# Altium schematic sheet SensorCheck.SchDoc
size A
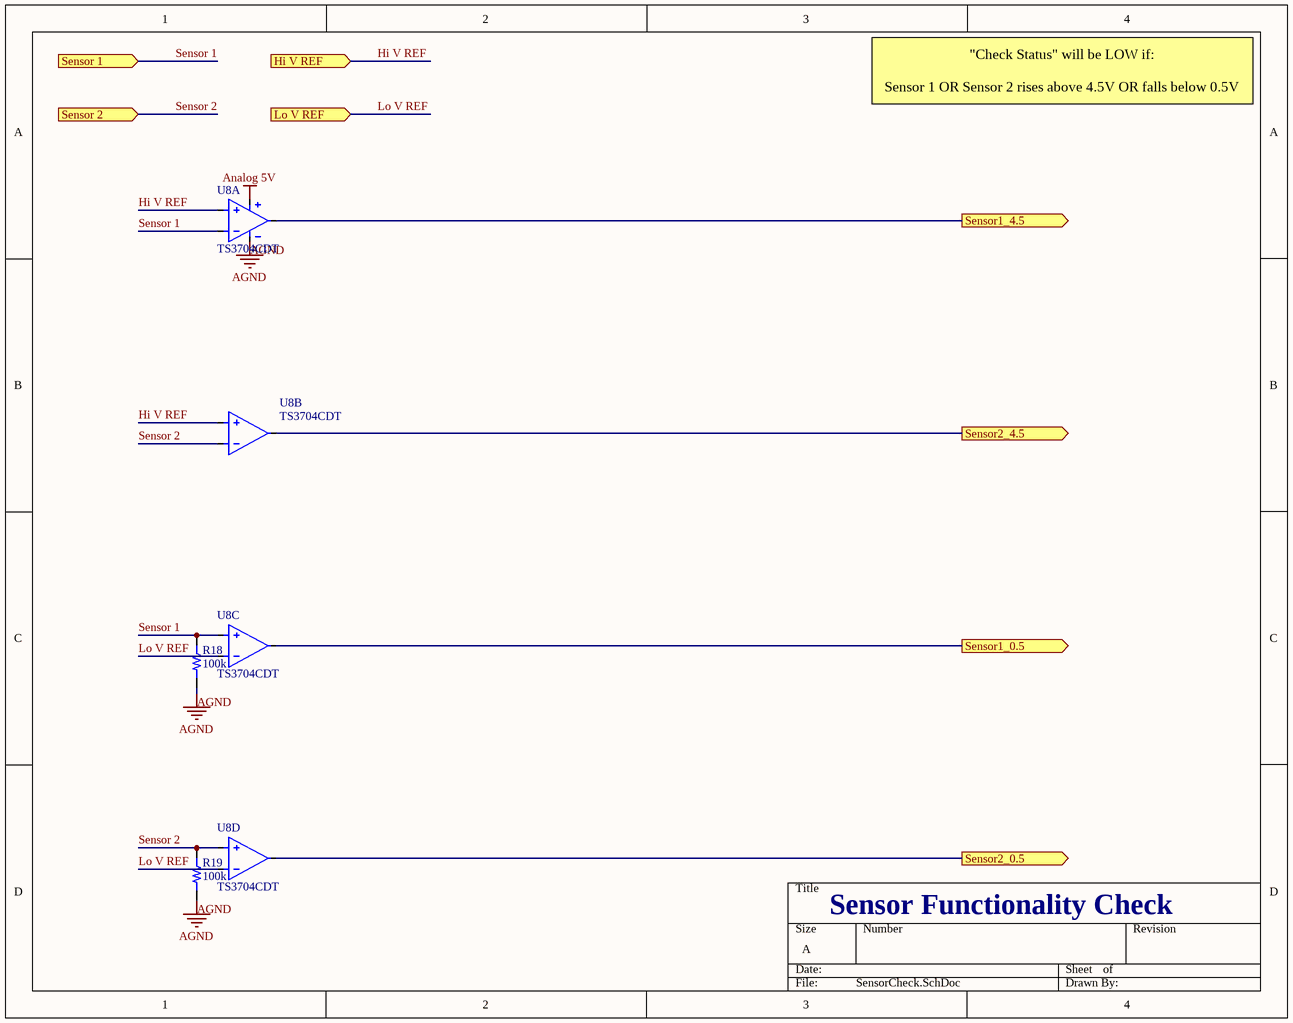
[diagram p0: SensorCheck.SchDoc]

## Parts
R18  resistance: 100k  [RES 0603/1608]  (hidden comment: resistor)
R19  resistance: 100k  [RES 0603/1608]  (hidden comment: resistor)
U8  TS3704CDT  [SOIC-14]  (parts A,B,C,D of 4)

## Ports
Hi V REF (in), Lo V REF (in), Sensor1_0.5 (out), Sensor1_4.5 (out), Sensor2_0.5 (out), Sensor2_4.5 (out), Sensor 1 (in), Sensor 2 (in)

## Nets
AGND: R18.1 R19.1 U8.12(V-)
Analog 5V: U8.3(V+)
Hi V REF: U8.5(+IN_1) U8.7(+IN_2) ; port Hi V REF
Lo V REF: U8.8(-IN_3) U8.10(-IN_4) ; port Lo V REF
Sensor1_0.5: U8.14(OUT_3) ; port Sensor1_0.5
Sensor1_4.5: U8.2(OUT_1) ; port Sensor1_4.5
Sensor2_0.5: U8.13(OUT_4) ; port Sensor2_0.5
Sensor2_4.5: U8.1(OUT_2) ; port Sensor2_4.5
Sensor 1: R18.2 U8.4(-IN_1) U8.9(+IN_3) ; port Sensor 1
Sensor 2: R19.2 U8.6(-IN_2) U8.11(+IN_4) ; port Sensor 2

## Notes on the sheet
- "Check Status" will be LOW if:
  Sensor 1 OR Sensor 2 rises above 4.5V OR falls below 0.5V
- Sensor Functionality Check

## Library data of the parts
R18 R19 = 1: id: 1; name: 0603 Resistor; percent tolerance: 5; package: 0603; quantity: 0
U8 = 42: Quad CMOS Comparators; id: 42; vcc: 18; voltageinmax: 12; AnnotateREF: Sens; name: TS3704CDT; package: SOIC-14; quantity: 0; link: https://www.digikey.com/product-detail/en/stmicroelectronics/TS3704CDT/497-4063-1-ND/720983; createdby: Kevin